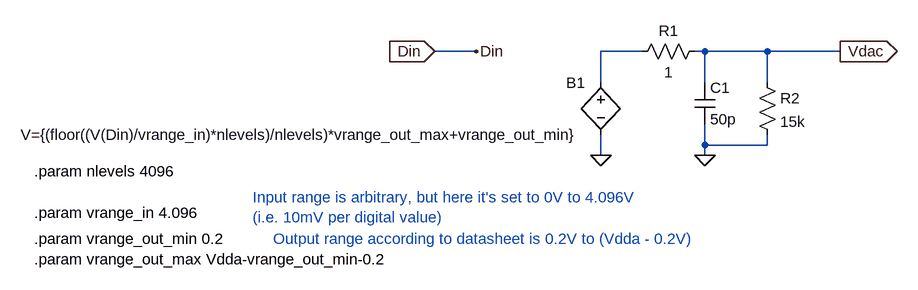
[diagram p0: schematic DAC_subcktConfig.asc]
DAC_subcktConfig.asc, the LTspice schematic file:
Version 4
SHEET 1 1824 680
WIRE 96 -224 32 -224
WIRE 352 -224 288 -224
WIRE 448 -224 432 -224
WIRE 544 -224 448 -224
WIRE 656 -224 544 -224
WIRE 288 -176 288 -224
WIRE 448 -176 448 -224
WIRE 544 -176 544 -224
WIRE 448 -80 448 -112
WIRE 544 -80 544 -96
WIRE 544 -80 448 -80
WIRE 288 -64 288 -96
WIRE 448 -64 448 -80
FLAG 656 -224 Vdac
IOPIN 656 -224 Out
FLAG 288 -64 0
FLAG 96 -224 Din
FLAG 32 -224 Din
IOPIN 32 -224 In
FLAG 448 -64 0
SYMBOL bv 288 -192 M0
SYMATTR InstName B1
SYMATTR Value V={(floor((V(Din)/vrange_in)*nlevels)/nlevels)*vrange_out_max+vrange_out_min}
SYMBOL res 448 -240 R90
WINDOW 0 0 56 VBottom 2
WINDOW 3 32 56 VTop 2
SYMATTR InstName R1
SYMATTR Value 1
SYMBOL cap 432 -176 R0
SYMATTR InstName C1
SYMATTR Value 50p
SYMBOL res 528 -192 R0
SYMATTR InstName R2
SYMATTR Value 15k
TEXT -584 -40 Left 2 !.param nlevels 4096
TEXT -584 24 Left 2 !.param vrange_in 4.096
TEXT -584 96 Left 2 !.param vrange_out_max Vdda-vrange_out_min-0.2
TEXT -584 64 Left 2 !.param vrange_out_min 0.2
TEXT -216 64 Left 2 ;Output range according to datasheet is 0.2V to (Vdda - 0.2V)
TEXT -248 0 Left 2 ;Input range is arbitrary, but here it's set to 0V to 4.096V\n(i.e. 10mV per digital value)

The netlist it stands for:
* DAC_subcktConfig.asc
B1 N001 0 V={(floor((V(Din)/vrange_in)*nlevels)/nlevels)*vrange_out_max+vrange_out_min}
R1 Vdac N001 1
C1 Vdac 0 50p
R2 Vdac 0 15k
.param nlevels 4096
.param vrange_in 4.096
.param vrange_out_max Vdda-vrange_out_min-0.2
.param vrange_out_min 0.2
* Output range according to datasheet is 0.2V to (Vdda - 0.2V)
* Input range is arbitrary, but here it's set to 0V to 4.096V
* (i.e. 10mV per digital value)
.backanno
.end